# Altium schematic sheet DB.SchDoc: {Наименование}
size 420 x 297 mm; DocumentNumber: ПЛАС.ХХХХХХ.ХХХ ХХ; SheetNumber: 7; SheetTotal: 11; PageSetup: Record=PageOptions|CenterHorizontal=False|CenterVertical=False|PrintScale=0.95|XCorrection=0.00|YCorrection=0.00|PrintKind=1|BorderSize=5000000|LeftOffset=0|BottomOffset=0|Orientation=1|PaperLength=1000|PaperWidth=1000|Scale=100|PaperSource=15|PrintQuality=600|MediaType=1|DitherType=10|PaperKind=A4|PrintScaleMode=1; Rule: PcbType=ProtelPcb
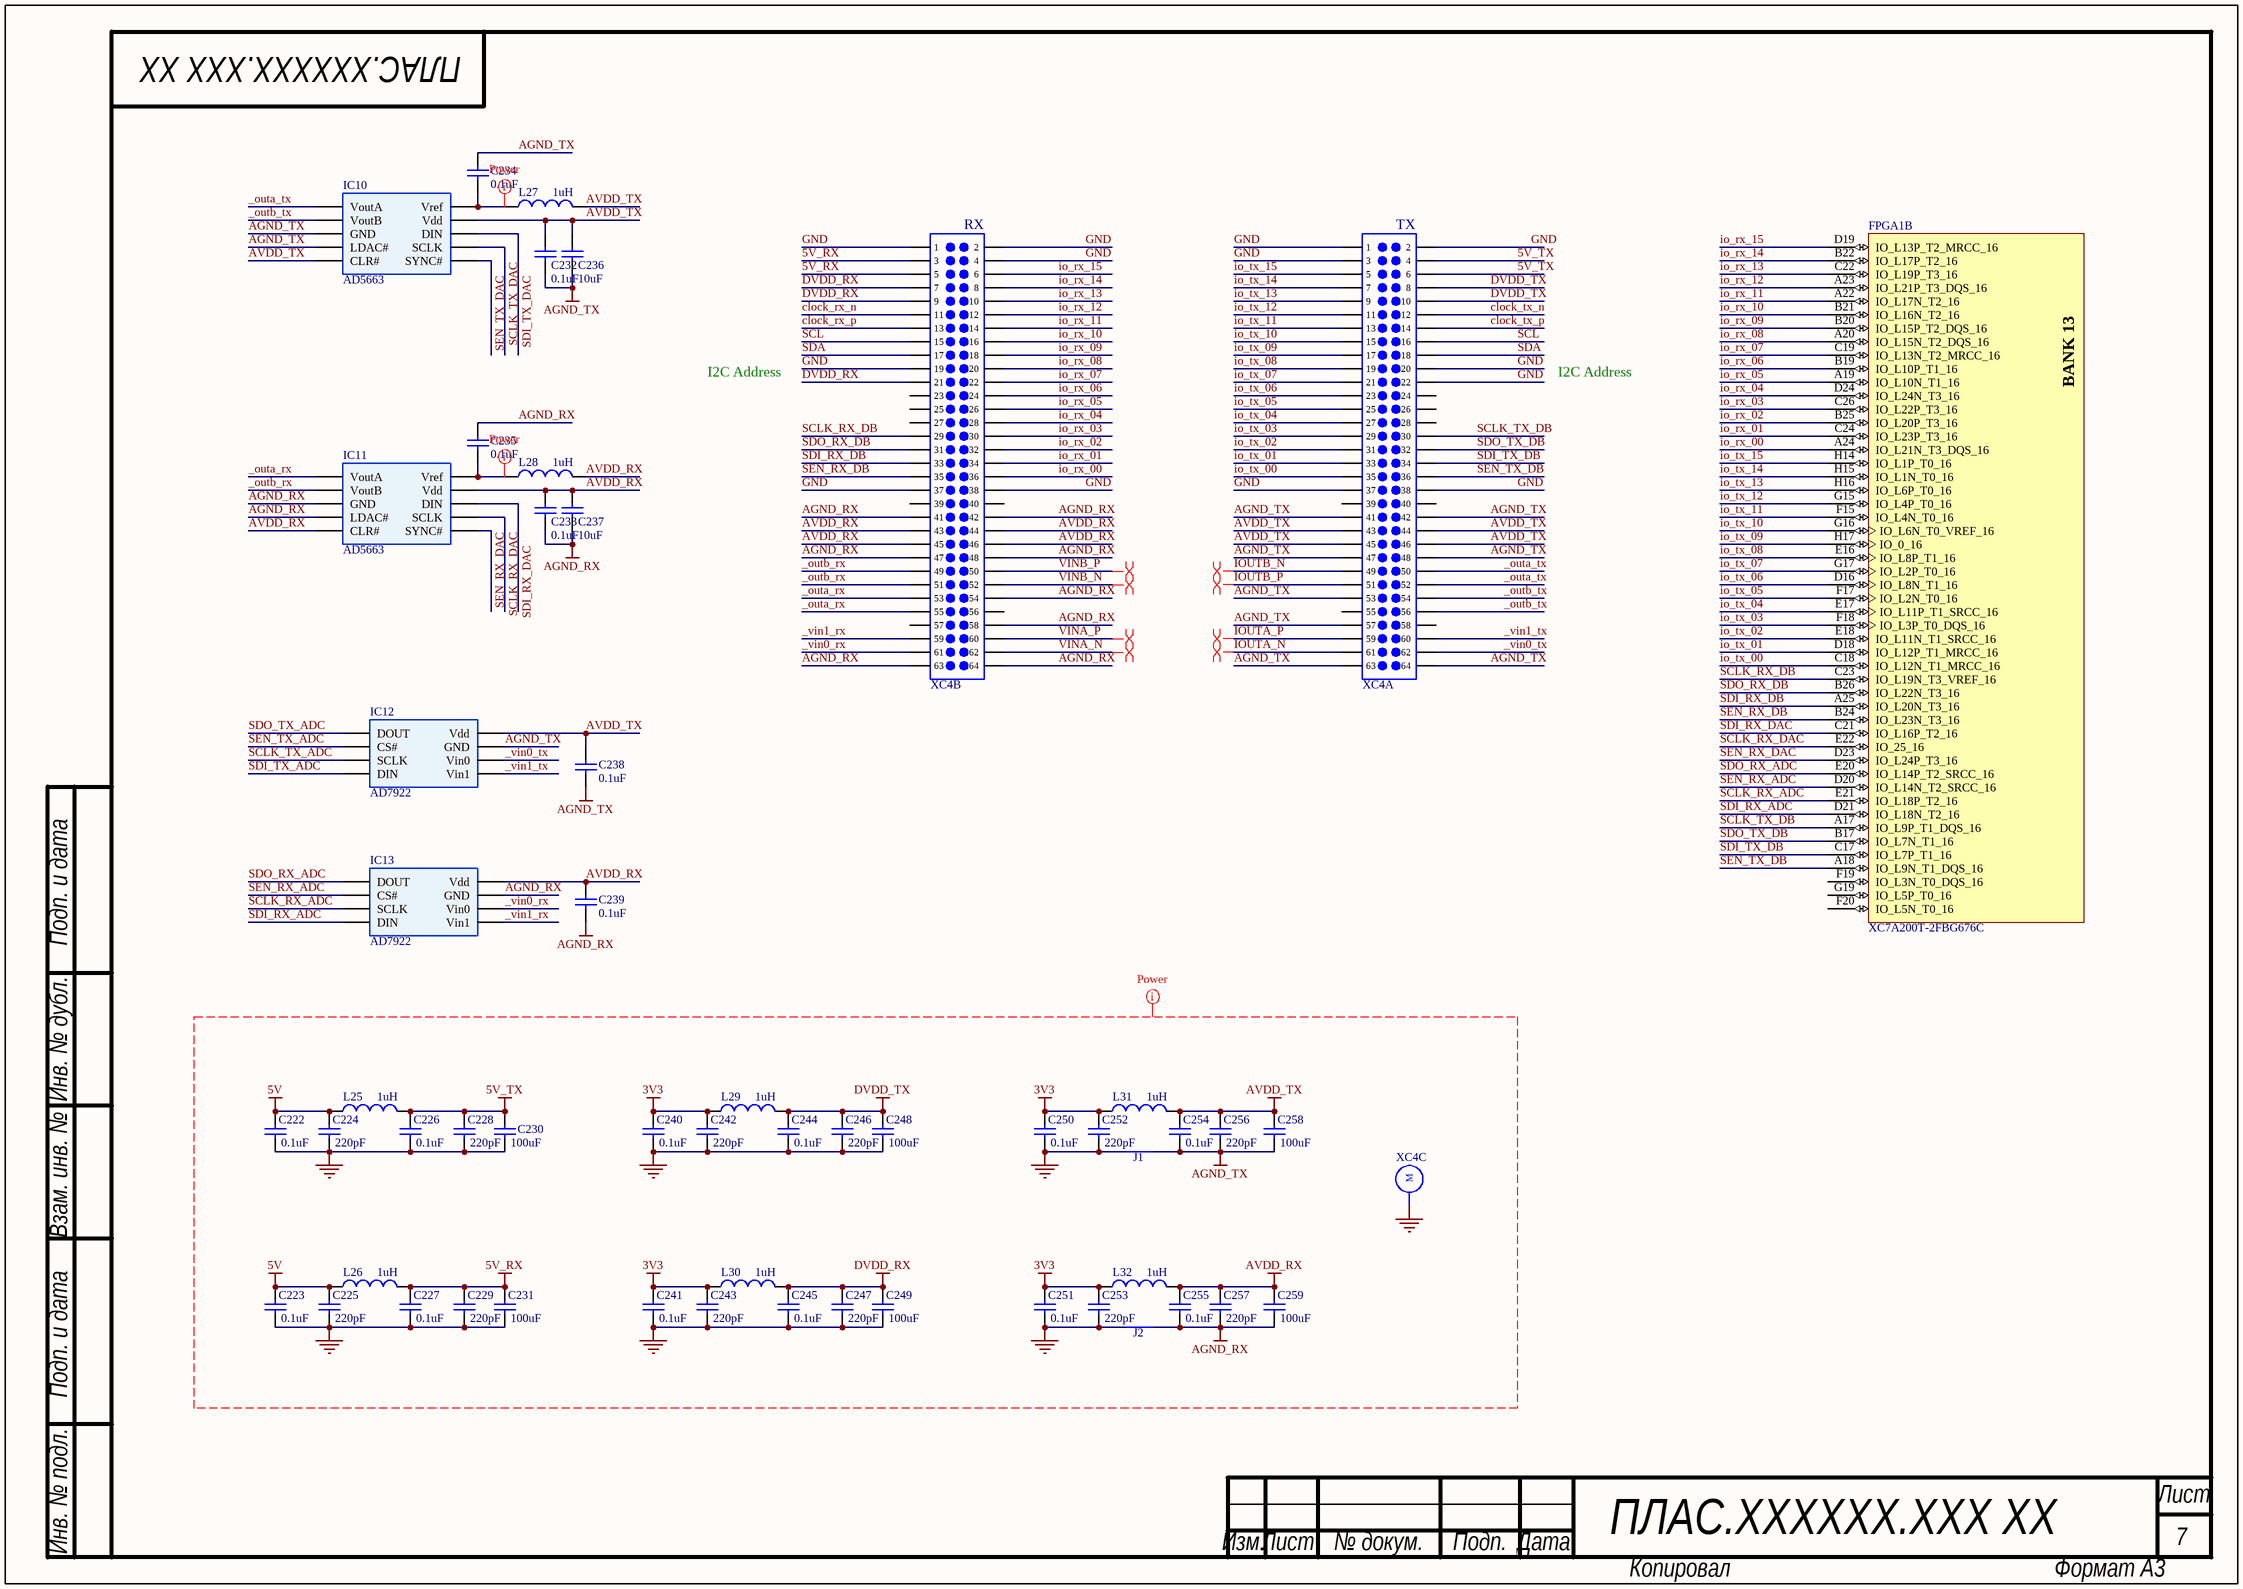
[diagram p0: DB.SchDoc]

## Parts
C222  value 0.1uF  [C0603]  (hidden comment: Cap)
C223  value 0.1uF  [C0603]  (hidden comment: Cap)
C224  value 220pF  [C0603]  (hidden comment: Cap)
C225  value 220pF  [C0603]  (hidden comment: Cap)
C226  value 0.1uF  [C0603]  (hidden comment: Cap)
C227  value 0.1uF  [C0603]  (hidden comment: Cap)
C228  value 220pF  [C0603]  (hidden comment: Cap)
C229  value 220pF  [C0603]  (hidden comment: Cap)
C230  value 100uF  [C1210]  (hidden comment: Cap)
C231  value 100uF  [C1210]  (hidden comment: Cap)
C232  value 0.1uF  [C0603]  (hidden comment: Cap)
C233  value 0.1uF  [C0603]  (hidden comment: Cap)
C234  value 0.1uF  [C0603]  (hidden comment: Cap)
C235  value 0.1uF  [C0603]  (hidden comment: Cap)
C236  value 10uF  [C0603]  (hidden comment: Cap)
C237  value 10uF  [C0603]  (hidden comment: Cap)
C238  value 0.1uF  [C0603]  (hidden comment: Cap)
C239  value 0.1uF  [C0603]  (hidden comment: Cap)
C240  value 0.1uF  [C0603]  (hidden comment: Cap)
C241  value 0.1uF  [C0603]  (hidden comment: Cap)
C242  value 220pF  [C0603]  (hidden comment: Cap)
C243  value 220pF  [C0603]  (hidden comment: Cap)
C244  value 0.1uF  [C0603]  (hidden comment: Cap)
C245  value 0.1uF  [C0603]  (hidden comment: Cap)
C246  value 220pF  [C0603]  (hidden comment: Cap)
C247  value 220pF  [C0603]  (hidden comment: Cap)
C248  value 100uF  [C1210]  (hidden comment: Cap)
C249  value 100uF  [C1210]  (hidden comment: Cap)
C250  value 0.1uF  [C0603]  (hidden comment: Cap)
C251  value 0.1uF  [C0603]  (hidden comment: Cap)
C252  value 220pF  [C0603]  (hidden comment: Cap)
C253  value 220pF  [C0603]  (hidden comment: Cap)
C254  value 0.1uF  [C0603]  (hidden comment: Cap)
C255  value 0.1uF  [C0603]  (hidden comment: Cap)
C256  value 220pF  [C0603]  (hidden comment: Cap)
C257  value 220pF  [C0603]  (hidden comment: Cap)
C258  value 100uF  [C1210]  (hidden comment: Cap)
C259  value 100uF  [C1210]  (hidden comment: Cap)
FPGA1  XC7A200T-2FBG676C  [FGG676]  (part B of 14)
IC10  AD5663  [MSOP-10]
IC11  AD5663  [MSOP-10]
IC12  AD7922  [MSOP-8]
IC13  AD7922  [MSOP-8]
J1  JMP  [JUMPER]  (value not drawn)  (net tie, no BOM)
J2  JMP  [JUMPER]  (value not drawn)  (net tie, no BOM)
L25  value 1uH  [L1210_Murata LQH]  (hidden comment: Inductor_LF)
L26  value 1uH  [L1210_Murata LQH]  (hidden comment: Inductor_LF)
L27  value 1uH  [L1206_Murata]  (hidden comment: Inductor_LF)
L28  value 1uH  [L1206_Murata]  (hidden comment: Inductor_LF)
L29  value 1uH  [L1210_Murata LQH]  (hidden comment: Inductor_LF)
L30  value 1uH  [L1210_Murata LQH]  (hidden comment: Inductor_LF)
L31  value 1uH  [L1210_Murata LQH]  (hidden comment: Inductor_LF)
L32  value 1uH  [L1210_Murata LQH]  (hidden comment: Inductor_LF)
XC4  64-pin Male Mezzanine  [RFX]  (value not drawn)  (parts A,B,C of 3)

## Nets
3V3: C240.1 C241.1 C242.1 C243.1 C250.1 C251.1 C252.1 C253.1 L29.2 L30.2 L31.1 L32.1
5V: C222.1 C223.1 C224.1 C225.1 L25.1 L26.2
5V_RX: C227.1 C229.1 C231.1 L26.1 XC4.67(3) XC4.69(5)
5V_TX: C226.1 C228.1 C230.1 L25.2 XC4.4 XC4.6
AGND_RX: C233.2 C235.1 C237.2 C239.2 C255.2 C257.2 C259.2 IC11.3(GND) IC11.4(LDAC#) IC13.7(GND) J2.2 XC4.105(41) XC4.106(42) XC4.111(47) XC4.112(48) XC4.118(54) XC4.122(58) XC4.127(63) XC4.128(64)
AGND_TX: C232.2 C234.1 C236.2 C238.1 C254.2 C256.2 C258.2 IC10.3(GND) IC10.4(LDAC#) IC12.7(GND) J1.2 XC4.41 XC4.42 XC4.47 XC4.48 XC4.53 XC4.57 XC4.63 XC4.64
AVDD_RX: C233.1 C237.1 C239.1 C255.1 C257.1 C259.1 IC11.5(CLR#) IC11.9(Vdd) IC13.8(Vdd) L28.1 L32.2 XC4.107(43) XC4.108(44) XC4.109(45) XC4.110(46)
AVDD_TX: C232.1 C236.1 C238.2 C254.1 C256.1 C258.1 IC10.5(CLR#) IC10.9(Vdd) IC12.8(Vdd) L27.1 L31.2 XC4.43 XC4.44 XC4.45 XC4.46
DVDD_RX: C245.1 C247.1 C249.1 L30.1 XC4.71(7) XC4.73(9) XC4.85(21)
DVDD_TX: C244.1 C246.1 C248.1 L29.1 XC4.8 XC4.10
GND: C222.2 C223.2 C224.2 C225.2 C226.2 C227.2 C228.2 C229.2 C230.2 C231.2 C240.2 C241.2 C242.2 C243.2 C244.2 C245.2 C246.2 C247.2 C248.2 C249.2 C250.2 C251.2 C252.2 C253.2 J1.1 J2.1 XC4.0(M) XC4.1 XC4.2 XC4.3 XC4.20 XC4.22 XC4.37 XC4.38 XC4.65(1) XC4.66(2) XC4.68(4) XC4.83(19) XC4.101(37) XC4.102(38)
_outa_rx: IC11.1(VoutA) XC4.117(53) XC4.119(55)
_outa_tx: IC10.1(VoutA) XC4.50 XC4.52
_outb_rx: IC11.2(VoutB) XC4.113(49) XC4.115(51)
_outb_tx: IC10.2(VoutB) XC4.54 XC4.56
_vin0_rx: IC13.6(Vin0) XC4.125(61)
_vin0_tx: IC12.6(Vin0) XC4.62
_vin1_rx: IC13.5(Vin1) XC4.123(59)
_vin1_tx: IC12.5(Vin1) XC4.60
clock_rx_n: XC4.75(11)
clock_rx_p: XC4.77(13)
clock_tx_n: XC4.12
clock_tx_p: XC4.14
io_rx_00: FPGA1.A24(IO_L21N_T3_DQS_16) XC4.100(36)
io_rx_01: FPGA1.C24(IO_L23P_T3_16) XC4.98(34)
io_rx_02: FPGA1.B25(IO_L20P_T3_16) XC4.96(32)
io_rx_03: FPGA1.C26(IO_L22P_T3_16) XC4.94(30)
io_rx_04: FPGA1.D24(IO_L24N_T3_16) XC4.92(28)
io_rx_05: FPGA1.A19(IO_L10N_T1_16) XC4.90(26)
io_rx_06: FPGA1.B19(IO_L10P_T1_16) XC4.88(24)
io_rx_07: FPGA1.C19(IO_L13N_T2_MRCC_16) XC4.86(22)
io_rx_08: FPGA1.A20(IO_L15N_T2_DQS_16) XC4.84(20)
io_rx_09: FPGA1.B20(IO_L15P_T2_DQS_16) XC4.82(18)
io_rx_10: FPGA1.B21(IO_L16N_T2_16) XC4.80(16)
io_rx_11: FPGA1.A22(IO_L17N_T2_16) XC4.78(14)
io_rx_12: FPGA1.A23(IO_L21P_T3_DQS_16) XC4.76(12)
io_rx_13: FPGA1.C22(IO_L19P_T3_16) XC4.74(10)
io_rx_14: FPGA1.B22(IO_L17P_T2_16) XC4.72(8)
io_rx_15: FPGA1.D19(IO_L13P_T2_MRCC_16) XC4.70(6)
io_tx_00: FPGA1.C18(IO_L12N_T1_MRCC_16) XC4.35
io_tx_01: FPGA1.D18(IO_L12P_T1_MRCC_16) XC4.33
io_tx_02: FPGA1.E18(IO_L11N_T1_SRCC_16) XC4.31
io_tx_03: FPGA1.F18(IO_L3P_T0_DQS_16) XC4.29
io_tx_04: FPGA1.E17(IO_L11P_T1_SRCC_16) XC4.27
io_tx_05: FPGA1.F17(IO_L2N_T0_16) XC4.25
io_tx_06: FPGA1.D16(IO_L8N_T1_16) XC4.23
io_tx_07: FPGA1.G17(IO_L2P_T0_16) XC4.21
io_tx_08: FPGA1.E16(IO_L8P_T1_16) XC4.19
io_tx_09: FPGA1.H17(IO_0_16) XC4.17
io_tx_10: FPGA1.G16(IO_L6N_T0_VREF_16) XC4.15
io_tx_11: FPGA1.F15(IO_L4N_T0_16) XC4.13
io_tx_12: FPGA1.G15(IO_L4P_T0_16) XC4.11
io_tx_13: FPGA1.H16(IO_L6P_T0_16) XC4.9
io_tx_14: FPGA1.H15(IO_L1N_T0_16) XC4.7
io_tx_15: FPGA1.H14(IO_L1P_T0_16) XC4.5
IOUTA_N: XC4.61
IOUTA_P: XC4.59
IOUTB_N: XC4.49
IOUTB_P: XC4.51
SCL: XC4.16 XC4.79(15)
SCLK_RX_ADC: FPGA1.E21(IO_L18P_T2_16) IC13.3(SCLK)
SCLK_RX_DAC: FPGA1.E22(IO_25_16) IC11.7(SCLK)
SCLK_RX_DB: FPGA1.C23(IO_L19N_T3_VREF_16) XC4.93(29)
SCLK_TX_ADC: IC12.3(SCLK)
SCLK_TX_DAC: IC10.7(SCLK)
SCLK_TX_DB: FPGA1.A17(IO_L9P_T1_DQS_16) XC4.30
SDA: XC4.18 XC4.81(17)
SDI_RX_ADC: FPGA1.D21(IO_L18N_T2_16) IC13.4(DIN)
SDI_RX_DAC: FPGA1.C21(IO_L16P_T2_16) IC11.8(DIN)
SDI_RX_DB: FPGA1.A25(IO_L20N_T3_16) XC4.97(33)
SDI_TX_ADC: IC12.4(DIN)
SDI_TX_DAC: IC10.8(DIN)
SDI_TX_DB: FPGA1.C17(IO_L7P_T1_16) XC4.34
SDO_RX_ADC: FPGA1.E20(IO_L14P_T2_SRCC_16) IC13.1(DOUT)
SDO_RX_DB: FPGA1.B26(IO_L22N_T3_16) XC4.95(31)
SDO_TX_ADC: IC12.1(DOUT)
SDO_TX_DB: FPGA1.B17(IO_L7N_T1_16) XC4.32
SEN_RX_ADC: FPGA1.D20(IO_L14N_T2_SRCC_16) IC13.2(CS#)
SEN_RX_DAC: FPGA1.D23(IO_L24P_T3_16) IC11.6(SYNC#)
SEN_RX_DB: FPGA1.B24(IO_L23N_T3_16) XC4.99(35)
SEN_TX_ADC: IC12.2(CS#)
SEN_TX_DAC: IC10.6(SYNC#)
SEN_TX_DB: FPGA1.A18(IO_L9N_T1_DQS_16) XC4.36
VINA_N: XC4.126(62)
VINA_P: XC4.124(60)
VINB_N: XC4.116(52)
VINB_P: XC4.114(50)
NetC234_2: C234.2 IC10.10(Vref) L27.2
NetC235_2: C235.2 IC11.10(Vref) L28.2

Not connected (* = marked no-connect by the designer): FPGA1 F19(IO_L3N_T0_DQS_16) F20(IO_L5N_T0_16) G19(IO_L5P_T0_16); XC4 24 26 28 39 40 55 58 87(23) 89(25) 91(27) 103(39) 104(40) 120(56) 121(57)

## Layout directives
net class Power: 3V3, 5V, 5V_RX, 5V_TX, AGND_RX, AGND_TX, AVDD_RX, AVDD_TX, DVDD_RX, DVDD_TX, GND, NetC234_2, NetC235_2
differential pair: IOUTA_N, IOUTA_P, IOUTB_N, IOUTB_P, VINA_N, VINA_P, VINB_N, VINB_P

## Notes on the sheet
- I2C Address
- Подп. и дата
- Инв. № дубл.
- Взам. инв. №
- Инв. № подл.
- Лист
- Изм.
- № докум.
- Подп.
- Дата
- Копировал
- Формат А3
- (in symbol RFX, part A) TX
- (in symbol RFX, part B) RX
- (in symbol XC7A200T-2FBG676C, part B) BANK 13

## Library data of the parts
C222-C229 C232-C235 C238-C247 C250-C257 = Cer Cap: Cer Cap Small; Manufacturer: Murata; Material: x5r; Voltage: 16V; Tolerance: 10%; Type: Ceramic; PackageReference: SMD Chip Capacitor; Package: 0603
C230 C231 C248 C249 C258 C259 = Cap uF: Cer Cap Large; Manufacturer: Murata; Material: x5r; Tolerance: 20%; Voltage: 6.3V; Type: Ceramic; Package: C1210; PackageDescription: SMD Chip Capacitor
C236 C237 = Cer Cap: Cer Cap Small; Manufacturer: Murata; Material: x5r; Voltage: 6.3V; Tolerance: 10%; Type: Ceramic; PackageReference: SMD Chip Capacitor; Package: 0603
FPGA1 = XC7A200T-2FBG676C: Artix-7 FPGA, 400 User I/Os, 8 GTP, 676-Ball BGA, Speed Grade 2, Commercial Grade, Pb-Free; Manufacturer: Xilinx; Block RAM Blocks (18Kb): 730; Block RAM Blocks (36Kb): 365; Block RAM Blocks (Max Kb): 13140; CLBs (Slices): 33650; Clock Mgmt Tiles (CMTs): 10; DSP48E1 Slices: 740; Logic Cells: 215360; Max User I/O: 500; Speed Grade: -2; DatasheetVersion: v1.12; PackageVersion: Rev 1.8; PackageReference: FBG676; PackageDescription: Flip-Chip Lidless BGA, Body 27 x 27 mm, 1.0 mm Pitch; Supplier 1: Digi-Key; Supplier Part Number 1: 122-1865-ND; CLBs (Max Distributed RAM Kb): 2888; Generic Part Number: XC7A200T; RoHS: Pb-Free; NexusDeviceID: XC7A200T-2FBG676C; Mounting Technology: Surface Mount; Code_JEDEC: MS-034; PartNumber: XC7A200T-2FBG676C; ComponentLink1Description: Manufacturer URL; ComponentLink1URL: http://www.xilinx.com/; ComponentLink2Description: Datasheet; ComponentLink2URL: http://www.xilinx.com/support/documentation/data_sheets/ds180_7Series_Overview.pdf; ComponentLink3Description: Package Specification; ComponentLink3URL: http://www.xilinx.com/support/documentation/user_guides/ug475_7Series_Pkg_Pinout.pdf; ComponentLink4Description: DC and Switching Characteristics; ComponentLink4URL: http://www.xilinx.com/support/documentation/data_sheets/ds181_Artix_7_Data_Sheet.pdf; ComponentLink5Description: Package File; ComponentLink5URL: http://www.xilinx.com/support/packagefiles/a7packages/xc7a200tfbg676pkg.txt; ComponentLink6Description: Packaging and Pinout; ComponentLink6URL: http://www.xilinx.com/support/documentation/user_guides/ug475_7Series_Pkg_Pinout.pdf
IC10 IC11 = AD56x3R: Dual 12-/14-/16-Bit nanoDAC; Manufacturer: Analog Device; Name: AD5663RBRMZ-5; settling time: 4.5 μs maximum; Voltage: 2.7 V to 5.5 V; High speed serial interface: SPI®/QSPI™/MICROWIRE™/DSP compatible; Type: Dual 12-/14-/16-Bit nanoDAC with 5 ppm/°C On-Chip Reference; Package: MSOP-10
IC12 IC13 = AD79x2: 1 MSPS, 10-/12-Bit ADC; Manufacturer: Analog Device; Name: AD7922ARM; Fast throughput rate: 1MHz; Voltage: 2.35 V to 5.25 V; High speed serial interface: SPI®/QSPI™/MICROWIRE™/DSP compatible; Type: 2-Channel, 2.35 V to 5.25 V,1 MSPS, 10-/12-Bit ADC; Package: MSOP-8
J1 J2 = JMP: PGND & AGND Connect; Rule: UNIONINDEX{}0[]RULEKIND{}Width[]NETSCOPE{}AnyNet[]LAYERKIND{}SameLayer[]NAME{}Schematic Width Constraint[]MAXLIMIT{}59.0551mil[]MINLIMIT{}10mil[]PREFEREDWIDTH{}10mil[]MIDLAYER5_MAXWIDTH{}19.685mil[]MIDLAYER6_MAXWIDTH{}19.685mil[]MIDLAYER7_MAXWIDTH{}19.685mil[]MIDLAYER8_MAXWIDTH{}19.685mil[]MIDLAYER9_MAXWIDTH{}19.685mil[]MIDLAYER10_MAXWIDTH{}19.685mil[]MIDLAYER11_MAXWIDTH{}19.685mil[]MIDLAYER12_MAXWIDTH{}19.685mil[]MIDLAYER13_MAXWIDTH{}19.685mil[]MIDLAYER14_MAXWIDTH{}19.685mil[]MIDLAYER15_MAXWIDTH{}19.685mil[]MIDLAYER16_MAXWIDTH{}19.685mil[]MIDLAYER17_MAXWIDTH{}19.685mil[]MIDLAYER18_MAXWIDTH{}19.685mil[]MIDLAYER19_MAXWIDTH{}19.685mil[]MIDLAYER20_MAXWIDTH{}19.685mil[]MIDLAYER21_MAXWIDTH{}19.685mil[]MIDLAYER22_MAXWIDTH{}19.685mil[]MIDLAYER23_MAXWIDTH{}19.685mil[]MIDLAYER24_MAXWIDTH{}19.685mil[]MIDLAYER25_MAXWIDTH{}19.685mil[]MIDLAYER26_MAXWIDTH{}19.685mil[]MIDLAYER27_MAXWIDTH{}19.685mil[]MIDLAYER28_MAXWIDTH{}19.685mil[]MIDLAYER29_MAXWIDTH{}19.685mil[]MIDLAYER30_MAXWIDTH{}19.685mil[]MINIMP{}50.000000[]MAXIMP{}50.000000[]FAVIMP{}50.000000[]UNIT{}Metric[]PcbType{}ProtelPcb
L25 L26 L29-L32 = Inductor_LF: Inductor_Power_Lines; Manufacturer: Murata; Name: LQH32PN1R0NNC; Tolerance: 5%; Current: 2500mA; Frequency: 100MHz; Package: 1210; PackageDescription: Chip Inductor; Temperature Range: -25…85; Series: LQH
L27 L28 = Inductor_LF: Inductor_Power_Lines; Manufacturer: Murata; Name: LQM31PN1R0M00; Tolerance: 5%; Current: 1200mA; Frequency: 60MHz; Package: 1206; PackageDescription: Chip Inductor; Temperature Range: -25…85; Series: LQM
XC4 = RFX: Name: 1.00mm Pitch Mezzanine 714362164